# Altium schematic sheet deepshark_power_sch.SchDoc
size A4
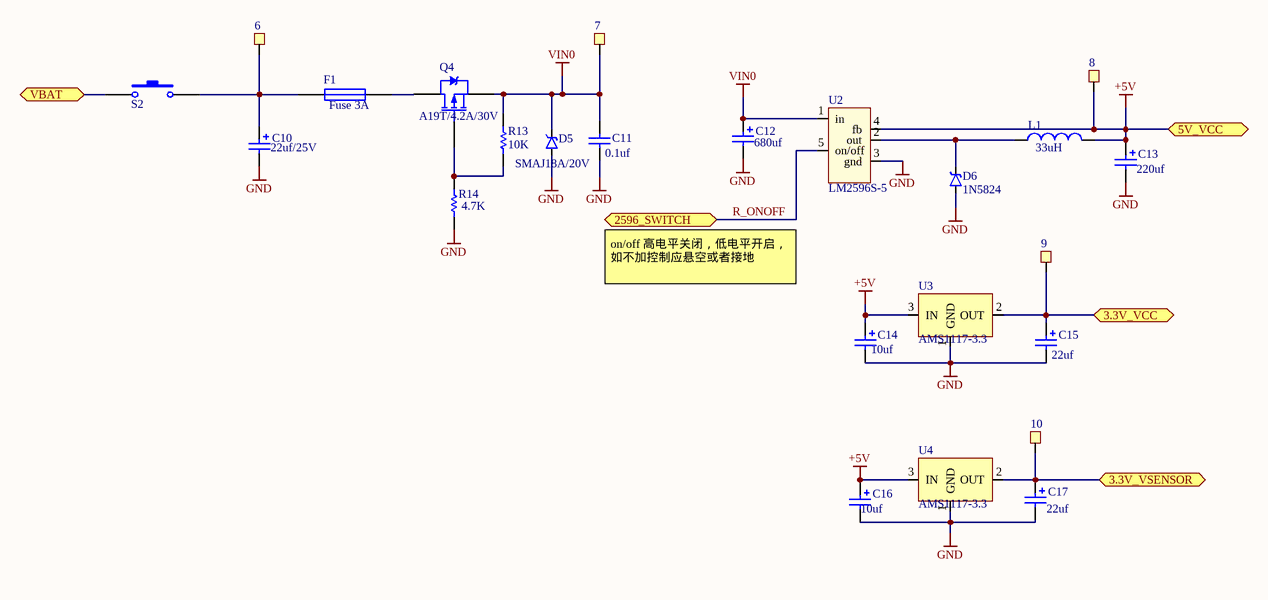
[diagram p0: deepshark_power_sch.SchDoc]

## Parts
6  TP  [TestPoint]  (value not drawn)
7  TP  [TestPoint]  (value not drawn)
8  TP  [TestPoint]  (value not drawn)
9  TP  [TestPoint]  (value not drawn)
10  TP  [TestPoint]  (value not drawn)
C10  value 22uf/25V  [22uf-25V]  (hidden comment: Cap Pol2)
C11  value 0.1uf  [6-0805_M]  (hidden comment: Cap)
C12  value 680uf  [680uf-50v]  (hidden comment: Cap Pol2)
C13  value 220uf  [220uf-50v]  (hidden comment: Cap Pol2)
C14  value 10uf  [1206]  (hidden comment: Cap Pol2)
C15  value 22uf  [my0603]  (hidden comment: Cap Pol2)
C16  value 10uf  [1206]  (hidden comment: Cap Pol2)
C17  value 22uf  [my0603]  (hidden comment: Cap Pol2)
D5  SMAJ18A/20V  [SMBJ6.5A]
D6  1N5824  [1N5824]
F1  Fuse 3A  [1206]
L1  value 33uH  [12x12 L]  (hidden comment: Inductor)
Q4  A19T/4.2A/30V  [A19T]
R13  value 10K  [6-0805_M]  (hidden comment: Res1)
R14  value 4.7K  [6-0805_M]  (hidden comment: Res1)
S2  SW-PB  [switch-2bit]  (value not drawn)
U2  LM2596S-5  [LM2596]
U3  AMS1117-3.3  [SOT223_M]
U4  AMS1117-3.3  [SOT223_M]

## Ports
3.3V_VCC, 3.3V_VSENSOR, 5V_VCC, 2596_SWITCH, VBAT

## Nets
+5V: 8.1 C13.1 C14.1 C16.1 L1.2 U2.4(fb) U3.3(IN) U4.3(IN) ; port 5V_VCC
GND: C10.2 C11.1 C12.2 C13.2 C14.2 C15.2 C16.2 C17.2 D5.A D6.A R14.1 U2.3(gnd) U3.1(GND) U4.1(GND)
VIN0: 7.1 C11.2 C12.1 D5.K Q4.3(S) R13.1 U2.1(in)
3.3V_VCC: 9.1 C15.1 U3.2(OUT) ; port 3.3V_VCC
3.3V_VSENSOR: 10.1 C17.1 U4.2(OUT) ; port 3.3V_VSENSOR
R_ONOFF: U2.5(on/off) ; port 2596_SWITCH
VBAT: S2.2 ; port VBAT
Net6_1: 6.1 C10.1 F1.1 S2.1
NetD6_K: D6.K L1.1 U2.2(out)
NetF1_2: F1.2 Q4.2(D)
NetQ4_1: Q4.1(G) R13.2 R14.2

## Notes on the sheet
- on/off 高电平关闭，低电平开启，如不加控制应悬空或者接地

## Library data of the parts
C10 C12-C17 = Cap Pol2: Polarized Capacitor (Axial); Published: 8-Jun-2000; LatestRevisionDate: 17-Jul-2002; LatestRevisionNote: Re-released for DXP Platform.; PackageReference: POLAR0.8; Publisher: Altium Limited; PackageDescription: Polarized Capacitor; 2 Leads
C11 = Cap: Capacitor; Published: 8-Jun-2000; LatestRevisionDate: 17-Jul-2002; LatestRevisionNote: Re-released for DXP Platform.; PackageReference: RAD-0.3; Publisher: Altium Limited; PackageDescription: Radial Cap, Thru-Hole; 2 Leads; 0.3 in Pin Spacing
D5 D6 = DW
F1 = Fuse 1: Fuse; Published: 8-Jun-2000; LatestRevisionDate: 17-Jul-2002; LatestRevisionNote: Re-released for DXP Platform.; PackageReference: PIN-W2/E2.8; Publisher: Altium Limited; PackageDescription: Thru-Hole; 2 Leads
L1 = Inductor: Code_IEC: 1005; Published: 8-Jun-2000; LatestRevisionDate: 29-May-2009; LatestRevisionNote: IPC-7351 Footprint Added.; PackageReference: 0402-A; Publisher: Altium Limited; PackageDescription: Chip Inductor; Code_JEITA: 0402
Q4 = PMOS-2: P-Channel Power MOSFET; Note: Pin 4 not drawn and electrically connected to Pin 2.; Published: 8-Jun-2000; LatestRevisionDate: 17-Jul-2002; LatestRevisionNote: Re-released for DXP Platform.; DatasheetVersion: PD-9.390D; PackageVersion: Feb-1997; PackageReference: TO-220AB; Publisher: Altium Limited; PackageDescription: TO, Thru-Hole, Vertical, Heatsink Mounted; 3 In-Line Leads; Pitch 2.54 mm; ComponentLink1Description: Manufacturer Link; ComponentLink1URL: http://www.irf.com/
R13 R14 = Res1: Resistor; Published: 8-Jun-2000; LatestRevisionDate: 17-Jul-2002; LatestRevisionNote: Re-released for DXP Platform.; PackageReference: AXIAL-0.3; Publisher: Altium Limited; PackageDescription: Axial Device, Thru-Hole; 2 Leads; 0.3 in Pin Spacing
S2 = SW-PB: Switch; Published: 24-Mar-1999; LatestRevisionDate: 17-Jul-2002; LatestRevisionNote: Re-released for DXP Platform.; PackageReference: SPST-2; Publisher: Altium Limited; PackageDescription: Switch; 2 Leads